# EAGLE design basicBoard (EAGLE 6.5.0)
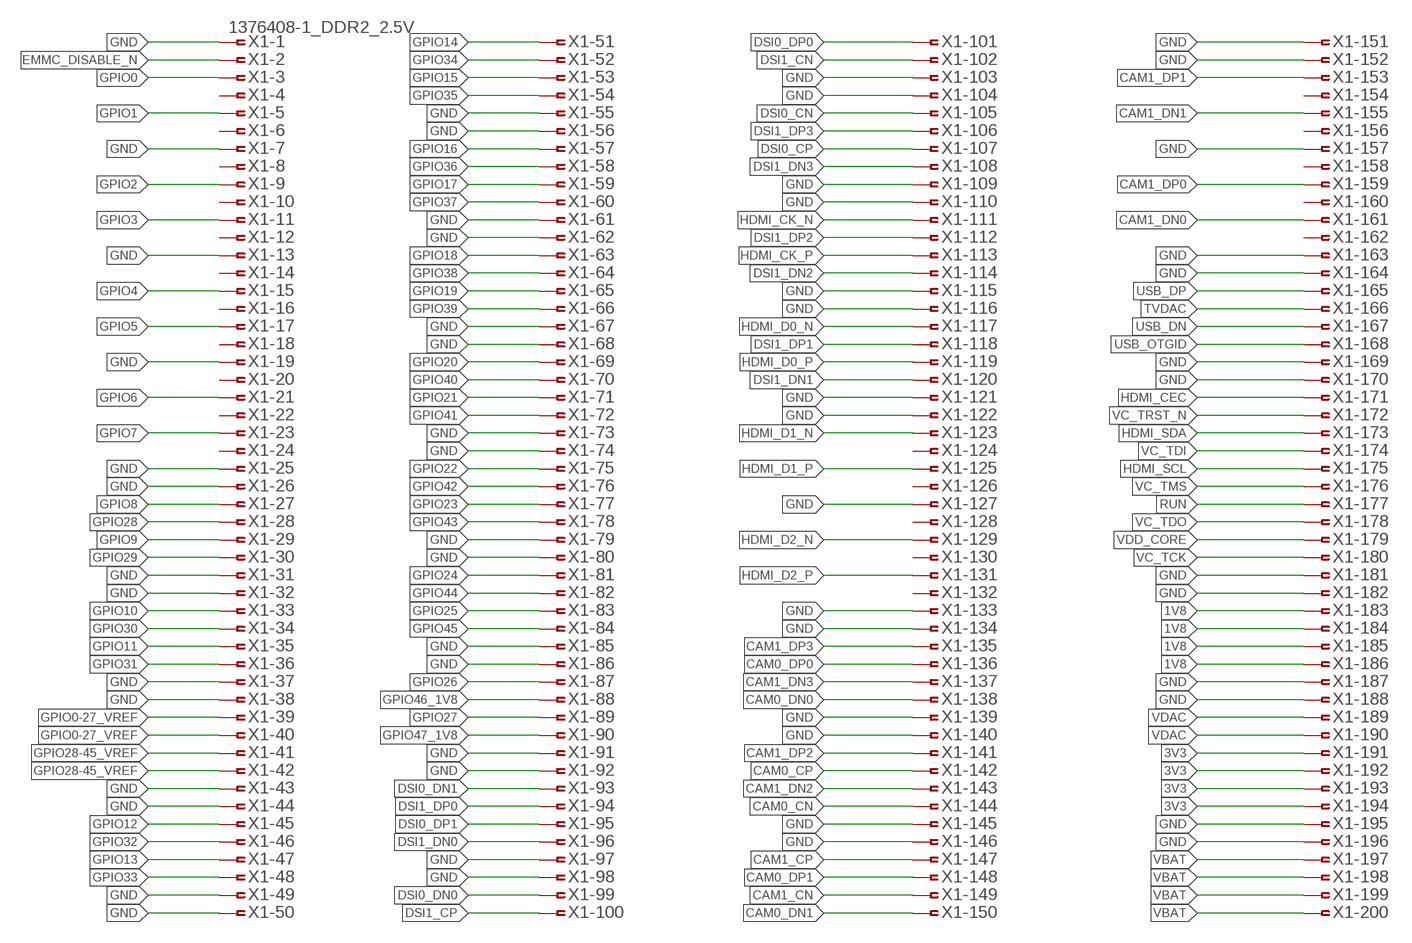
[diagram p0: schematic, sheet 1]

## Parts
X1  1376408-1_DDR2_2.5V  [6-1376408-1]

## Nets
1V8: X1.183 X1.184 X1.185 X1.186
3V3: X1.191 X1.192 X1.193 X1.194
CAM0_CN: X1.144
CAM0_CP: X1.142
CAM0_DN0: X1.138
CAM0_DN1: X1.150
CAM0_DP0: X1.136
CAM0_DP1: X1.148
CAM1_CN: X1.149
CAM1_CP: X1.147
CAM1_DN0: X1.161
CAM1_DN1: X1.155
CAM1_DN2: X1.143
CAM1_DN3: X1.137
CAM1_DP0: X1.159
CAM1_DP1: X1.153
CAM1_DP2: X1.141
CAM1_DP3: X1.135
DSI0_CN: X1.105
DSI0_CP: X1.107
DSI0_DN0: X1.99
DSI0_DN1: X1.93
DSI0_DP0: X1.101
DSI0_DP1: X1.95
DSI1_CN: X1.102
DSI1_CP: X1.100
DSI1_DN0: X1.96
DSI1_DN1: X1.120
DSI1_DN2: X1.114
DSI1_DN3: X1.108
DSI1_DP0: X1.94
DSI1_DP1: X1.118
DSI1_DP2: X1.112
DSI1_DP3: X1.106
EMMC_DISABLE_N: X1.2
GND: X1.1 X1.7 X1.13 X1.19 X1.25 X1.26 X1.31 X1.32 X1.37 X1.38 X1.43 X1.44 X1.49 X1.50 X1.55 X1.56 X1.61 X1.62 X1.67 X1.68 X1.73 X1.74 X1.79 X1.80 X1.85 X1.86 X1.91 X1.92 X1.97 X1.98 X1.103 X1.104 X1.109 X1.110 X1.115 X1.116 X1.121 X1.122 X1.127 X1.133 X1.134 X1.139 X1.140 X1.145 X1.146 X1.151 X1.152 X1.157 X1.163 X1.164 X1.169 X1.170 X1.181 X1.182 X1.187 X1.188 X1.195 X1.196
GPIO0: X1.3
GPIO0-27_VREF: X1.39 X1.40
GPIO1: X1.5
GPIO2: X1.9
GPIO3: X1.11
GPIO4: X1.15
GPIO5: X1.17
GPIO6: X1.21
GPIO7: X1.23
GPIO8: X1.27
GPIO9: X1.29
GPIO10: X1.33
GPIO11: X1.35
GPIO12: X1.45
GPIO13: X1.47
GPIO14: X1.51
GPIO15: X1.53
GPIO16: X1.57
GPIO17: X1.59
GPIO18: X1.63
GPIO19: X1.65
GPIO20: X1.69
GPIO21: X1.71
GPIO22: X1.75
GPIO23: X1.77
GPIO24: X1.81
GPIO25: X1.83
GPIO26: X1.87
GPIO27: X1.89
GPIO28: X1.28
GPIO28-45_VREF: X1.41 X1.42
GPIO29: X1.30
GPIO30: X1.34
GPIO31: X1.36
GPIO32: X1.46
GPIO33: X1.48
GPIO34: X1.52
GPIO35: X1.54
GPIO36: X1.58
GPIO37: X1.60
GPIO38: X1.64
GPIO39: X1.66
GPIO40: X1.70
GPIO41: X1.72
GPIO42: X1.76
GPIO43: X1.78
GPIO44: X1.82
GPIO45: X1.84
GPIO46_1V8: X1.88
GPIO47_1V8: X1.90
HDMI_CEC: X1.171
HDMI_CK_N: X1.111
HDMI_CK_P: X1.113
HDMI_D0_N: X1.117
HDMI_D0_P: X1.119
HDMI_D1_N: X1.123
HDMI_D1_P: X1.125
HDMI_D2_N: X1.129
HDMI_D2_P: X1.131
HDMI_SCL: X1.175
HDMI_SDA: X1.173
RUN: X1.177
TVDAC: X1.166
USB_DN: X1.167
USB_DP: X1.165
USB_OTGID: X1.168
VBAT: X1.197 X1.198 X1.199 X1.200
VC_TCK: X1.180
VC_TDI: X1.174
VC_TDO: X1.178
VC_TMS: X1.176
VC_TRST_N: X1.172
VDAC: X1.189 X1.190
VDD_CORE: X1.179
Unconnected: X1.4 X1.6 X1.8 X1.10 X1.12 X1.14 X1.16 X1.18 X1.20 X1.22 X1.24 X1.124 X1.126 X1.128 X1.130 X1.132 X1.154 X1.156 X1.158 X1.160 X1.162

## Library data of the parts
X1 = con-amp:1376408: DDR1 & DDR2 SODIMM SOCKET 0.6mm Pitch 200 Pos. Standard Profile, Standard Type (used on Kontron X-Board) Source: http://catalog.tycoelectronics.com .. JPN_CD_1376408_S.pdf

## Board
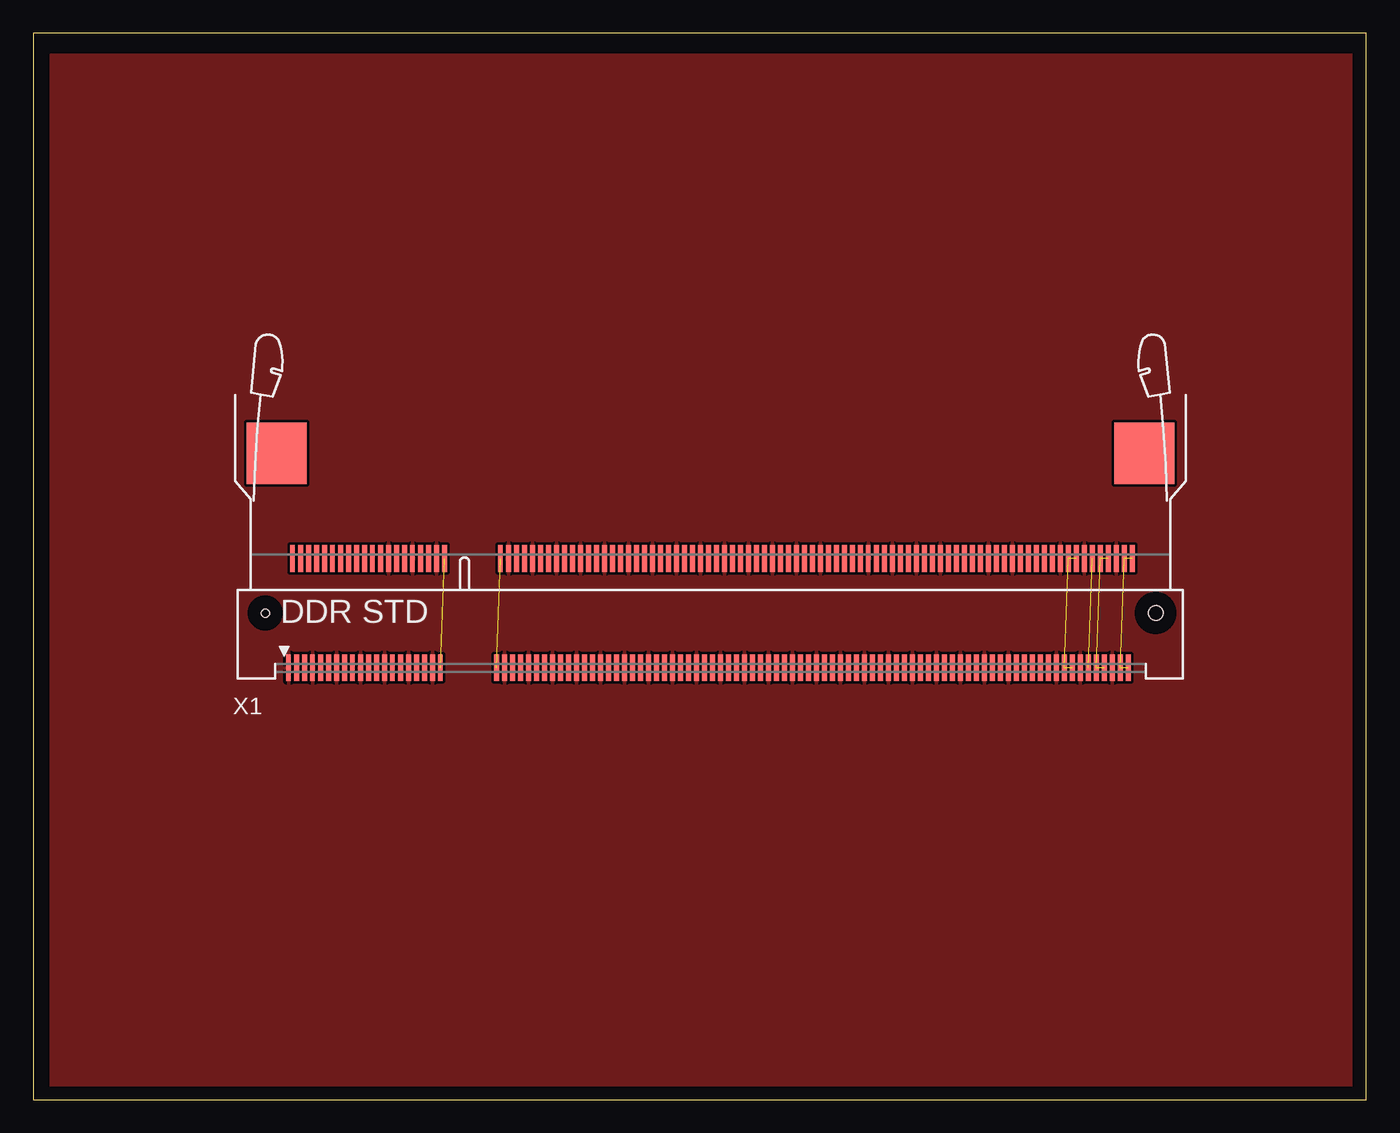
[diagram p1: board, top side]

Size 100 x 80 mm. Coordinates in mm from the lower left corner, seen from the top.
Outline: 0,0 100,0 100,80 0,80 0,0
Copper layers (1*16): Top 0.035mm / dielectric 1.5mm / Bottom 0.035mm
Design rules "default": minimum track width 10mil, minimum drill 24mil, track to track 8mil, track to pad 8mil, pad to pad 8mil, via to via 8mil, smd to smd 8mil, copper to edge 40mil, drill to drill 8mil, minimum pad ring 10mil, minimum via ring 8mil, stop-mask expansion 4mil, vias tented up to drill 0mil, thermal gap 10mil

### Footprints (pad centres in the part's own frame; a part is rotated, then mirrored left to right if it is on the bottom)
6-1376408-1 = smd 0.35 x 2: 1 -32.65,-4.1; 2 -32.35,4.1; 3 -32.05,-4.1; 4 -31.75,4.1; 5 -31.45,-4.1; 6 -31.15,4.1; 7 -30.85,-4.1; 8 -30.55,4.1; 9 -30.25,-4.1; 10 -29.95,4.1; 11 -29.65,-4.1; 12 -29.35,4.1; 13 -29.05,-4.1; 14 -28.75,4.1; 15 -28.45,-4.1; 16 -28.15,4.1; 17 -27.85,-4.1; 18 -27.55,4.1; 19 -27.25,-4.1; 20 -26.95,4.1; 21 -26.65,-4.1; 22 -26.35,4.1; 23 -26.05,-4.1; 24 -25.75,4.1; 25 -25.45,-4.1; 26 -25.15,4.1; 27 -24.85,-4.1; 28 -24.55,4.1; 29 -24.25,-4.1; 30 -23.95,4.1; 31 -23.65,-4.1; 32 -23.35,4.1; 33 -23.05,-4.1; 34 -22.75,4.1; 35 -22.45,-4.1; 36 -22.15,4.1; 37 -21.85,-4.1; 38 -21.55,4.1; 39 -21.25,-4.1; 40 -20.95,4.1; 41 -17.05,-4.1; 42 -16.75,4.1; 43 -16.45,-4.1; 44 -16.15,4.1; 45 -15.85,-4.1; 46 -15.55,4.1; 47 -15.25,-4.1; 48 -14.95,4.1; 49 -14.65,-4.1; 50 -14.35,4.1; 51 -14.05,-4.1; 52 -13.75,4.1; 53 -13.45,-4.1; 54 -13.15,4.1; 55 -12.85,-4.1; 56 -12.55,4.1; 57 -12.25,-4.1; 58 -11.95,4.1; 59 -11.65,-4.1; 60 -11.35,4.1; 61 -11.05,-4.1; 62 -10.75,4.1; 63 -10.45,-4.1; 64 -10.15,4.1; 65 -9.85,-4.1; 66 -9.55,4.1; 67 -9.25,-4.1; 68 -8.95,4.1; 69 -8.65,-4.1; 70 -8.35,4.1; 71 -8.05,-4.1; 72 -7.75,4.1; 73 -7.45,-4.1; 74 -7.15,4.1; 75 -6.85,-4.1; 76 -6.55,4.1; 77 -6.25,-4.1; 78 -5.95,4.1; 79 -5.65,-4.1; 80 -5.35,4.1; 81 -5.05,-4.1; 82 -4.75,4.1; 83 -4.45,-4.1; 84 -4.15,4.1; 85 -3.85,-4.1; 86 -3.55,4.1; 87 -3.25,-4.1; 88 -2.95,4.1; 89 -2.65,-4.1; 90 -2.35,4.1; 91 -2.05,-4.1; 92 -1.75,4.1; 93 -1.45,-4.1; 94 -1.15,4.1; 95 -0.85,-4.1; 96 -0.55,4.1; 97 -0.25,-4.1; 98 0.05,4.1; 99 0.35,-4.1; 100 0.65,4.1; 101 0.95,-4.1; 102 1.25,4.1; 103 1.55,-4.1; 104 1.85,4.1; 105 2.15,-4.1; 106 2.45,4.1; 107 2.75,-4.1; 108 3.05,4.1; 109 3.35,-4.1; 110 3.65,4.1; 111 3.95,-4.1; 112 4.25,4.1; 113 4.55,-4.1; 114 4.85,4.1; 115 5.15,-4.1; 116 5.45,4.1; 117 5.75,-4.1; 118 6.05,4.1; 119 6.35,-4.1; 120 6.65,4.1; 121 6.95,-4.1; 122 7.25,4.1; 123 7.55,-4.1; 124 7.85,4.1; 125 8.15,-4.1; 126 8.45,4.1; 127 8.75,-4.1; 128 9.05,4.1; 129 9.35,-4.1; 130 9.65,4.1; 131 9.95,-4.1; 132 10.25,4.1; 133 10.55,-4.1; 134 10.85,4.1; 135 11.15,-4.1; 136 11.45,4.1; 137 11.75,-4.1; 138 12.05,4.1; 139 12.35,-4.1; 140 12.65,4.1; 141 12.95,-4.1; 142 13.25,4.1; 143 13.55,-4.1; 144 13.85,4.1; 145 14.15,-4.1; 146 14.45,4.1; 147 14.75,-4.1; 148 15.05,4.1; 149 15.35,-4.1; 150 15.65,4.1; 151 15.95,-4.1; 152 16.25,4.1; 153 16.55,-4.1; 154 16.85,4.1; 155 17.15,-4.1; 156 17.45,4.1; 157 17.75,-4.1; 158 18.05,4.1; 159 18.35,-4.1; 160 18.65,4.1; 161 18.95,-4.1; 162 19.25,4.1; 163 19.55,-4.1; 164 19.85,4.1; 165 20.15,-4.1; 166 20.45,4.1; 167 20.75,-4.1; 168 21.05,4.1; 169 21.35,-4.1; 170 21.65,4.1; 171 21.95,-4.1; 172 22.25,4.1; 173 22.55,-4.1; 174 22.85,4.1; 175 23.15,-4.1; 176 23.45,4.1; 177 23.75,-4.1; 178 24.05,4.1; 179 24.35,-4.1; 180 24.65,4.1; 181 24.95,-4.1; 182 25.25,4.1; 183 25.55,-4.1; 184 25.85,4.1; 185 26.15,-4.1; 186 26.45,4.1; 187 26.75,-4.1; 188 27.05,4.1; 189 27.35,-4.1; 190 27.65,4.1; 191 27.95,-4.1; 192 28.25,4.1; 193 28.55,-4.1; 194 28.85,4.1; 195 29.15,-4.1; 196 29.45,4.1; 197 29.75,-4.1; 198 30.05,4.1; 199 30.35,-4.1; 200 30.65,4.1 | smd 4.5 x 4.6: M1 -33.55,12; M2 31.55,12 | hole 0.6: -34.4,0 | hole 1.1: 32.4,0

### Placement (x,y rotation side)
X1  51.8,36.5 0 top

### Tracks (layer width: path | path; a pad name or v marks a point on that pad's centre or on a via)
1V8  (3 unrouted)
3V3  (3 unrouted)
GND
  pour Top: 1.3,78.4 99.3,78.4 99.3,0.5 1.3,0.5
GPIO0-27_VREF  (1 unrouted)
GPIO28-45_VREF  (1 unrouted)
VBAT  (3 unrouted)
VDAC  (1 unrouted)